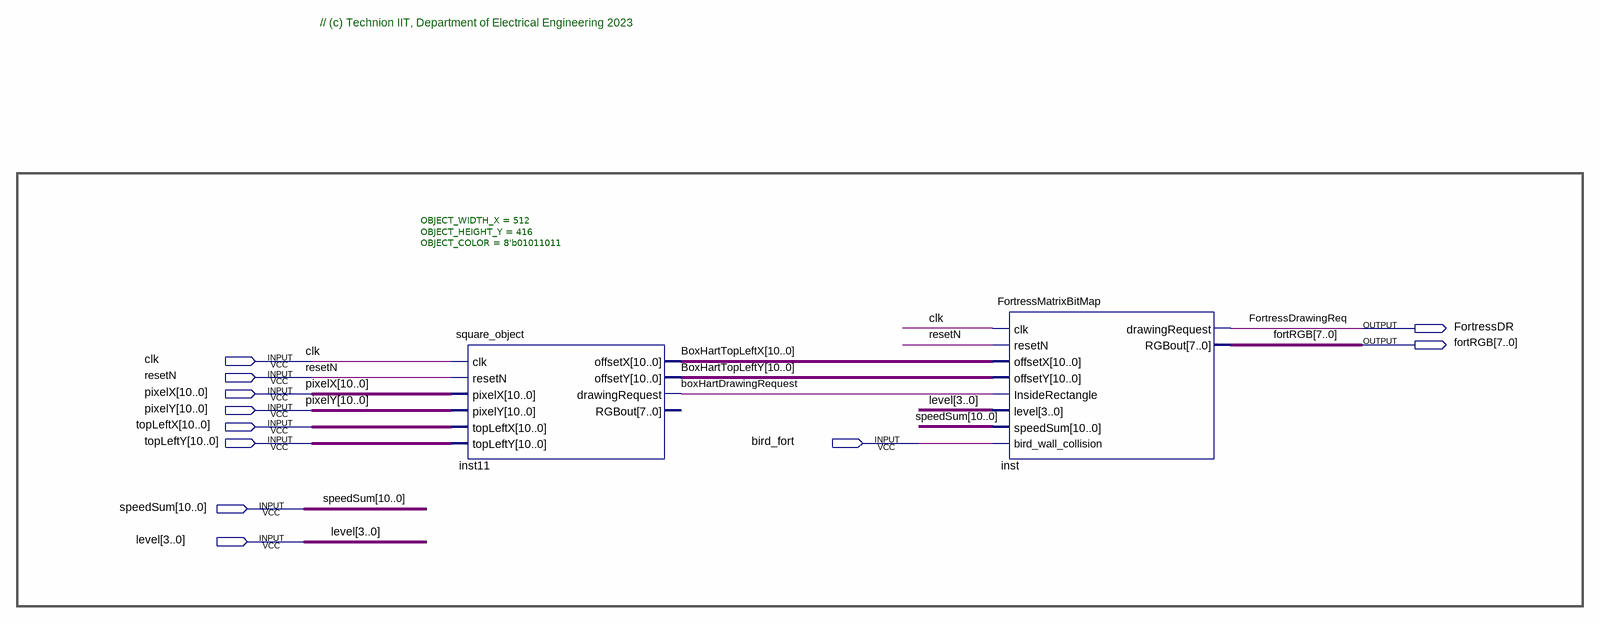
[diagram p0: schematic sheet]
// Quartus schematic FORT_DISPLAY.bdf as structural Verilog: 2 symbols, 11 pins
module FORT_DISPLAY (
  input  clk,
  input  resetN,
  input  [10:0] pixelX,
  input  [10:0] pixelY,
  input  [10:0] topLeftX,
  input  [10:0] topLeftY,
  input  bird_fort,
  input  [10:0] speedSum,
  input  [3:0] level,
  output FortressDR,
  output [7:0] fortRGB
);

  wire boxHartDrawingRequest;
  wire [10:0] BoxHartTopLeftX, BoxHartTopLeftY;

  square_object #(.OBJECT_WIDTH_X(512), .OBJECT_HEIGHT_Y(416), .OBJECT_COLOR(8'b01011011)) inst11 (
    .clk(clk), .resetN(resetN), .pixelX(pixelX), .pixelY(pixelY), .topLeftX(topLeftX), .topLeftY(topLeftY),
    .offsetX(BoxHartTopLeftX), .offsetY(BoxHartTopLeftY), .drawingRequest(boxHartDrawingRequest));  // open: RGBout
  FortressMatrixBitMap inst (
    .clk(clk), .resetN(resetN), .offsetX(BoxHartTopLeftX), .offsetY(BoxHartTopLeftY),
    .InsideRectangle(boxHartDrawingRequest), .level(level), .speedSum(speedSum),
    .bird_wall_collision(bird_fort), .drawingRequest(FortressDR), .RGBout(fortRGB));

  // Other names for the same wires on the sheet: FortressDrawingReq = FortressDR

  // Notes on the sheet:
  //   // (c) Technion IIT, Department of Electrical Engineering 2023
endmodule
